# EasyEDA Pro project ir2104_V2.1.eprj

# Schematic Schematic1
Create Date: 2023-10-16; Page Name: P1_1; Project Name: ir2104_V2; Schematic Name: Schematic1; Update Date: 2023-10-16; Company: 嘉立创EDA; Page Size: A4; Version: V1.0
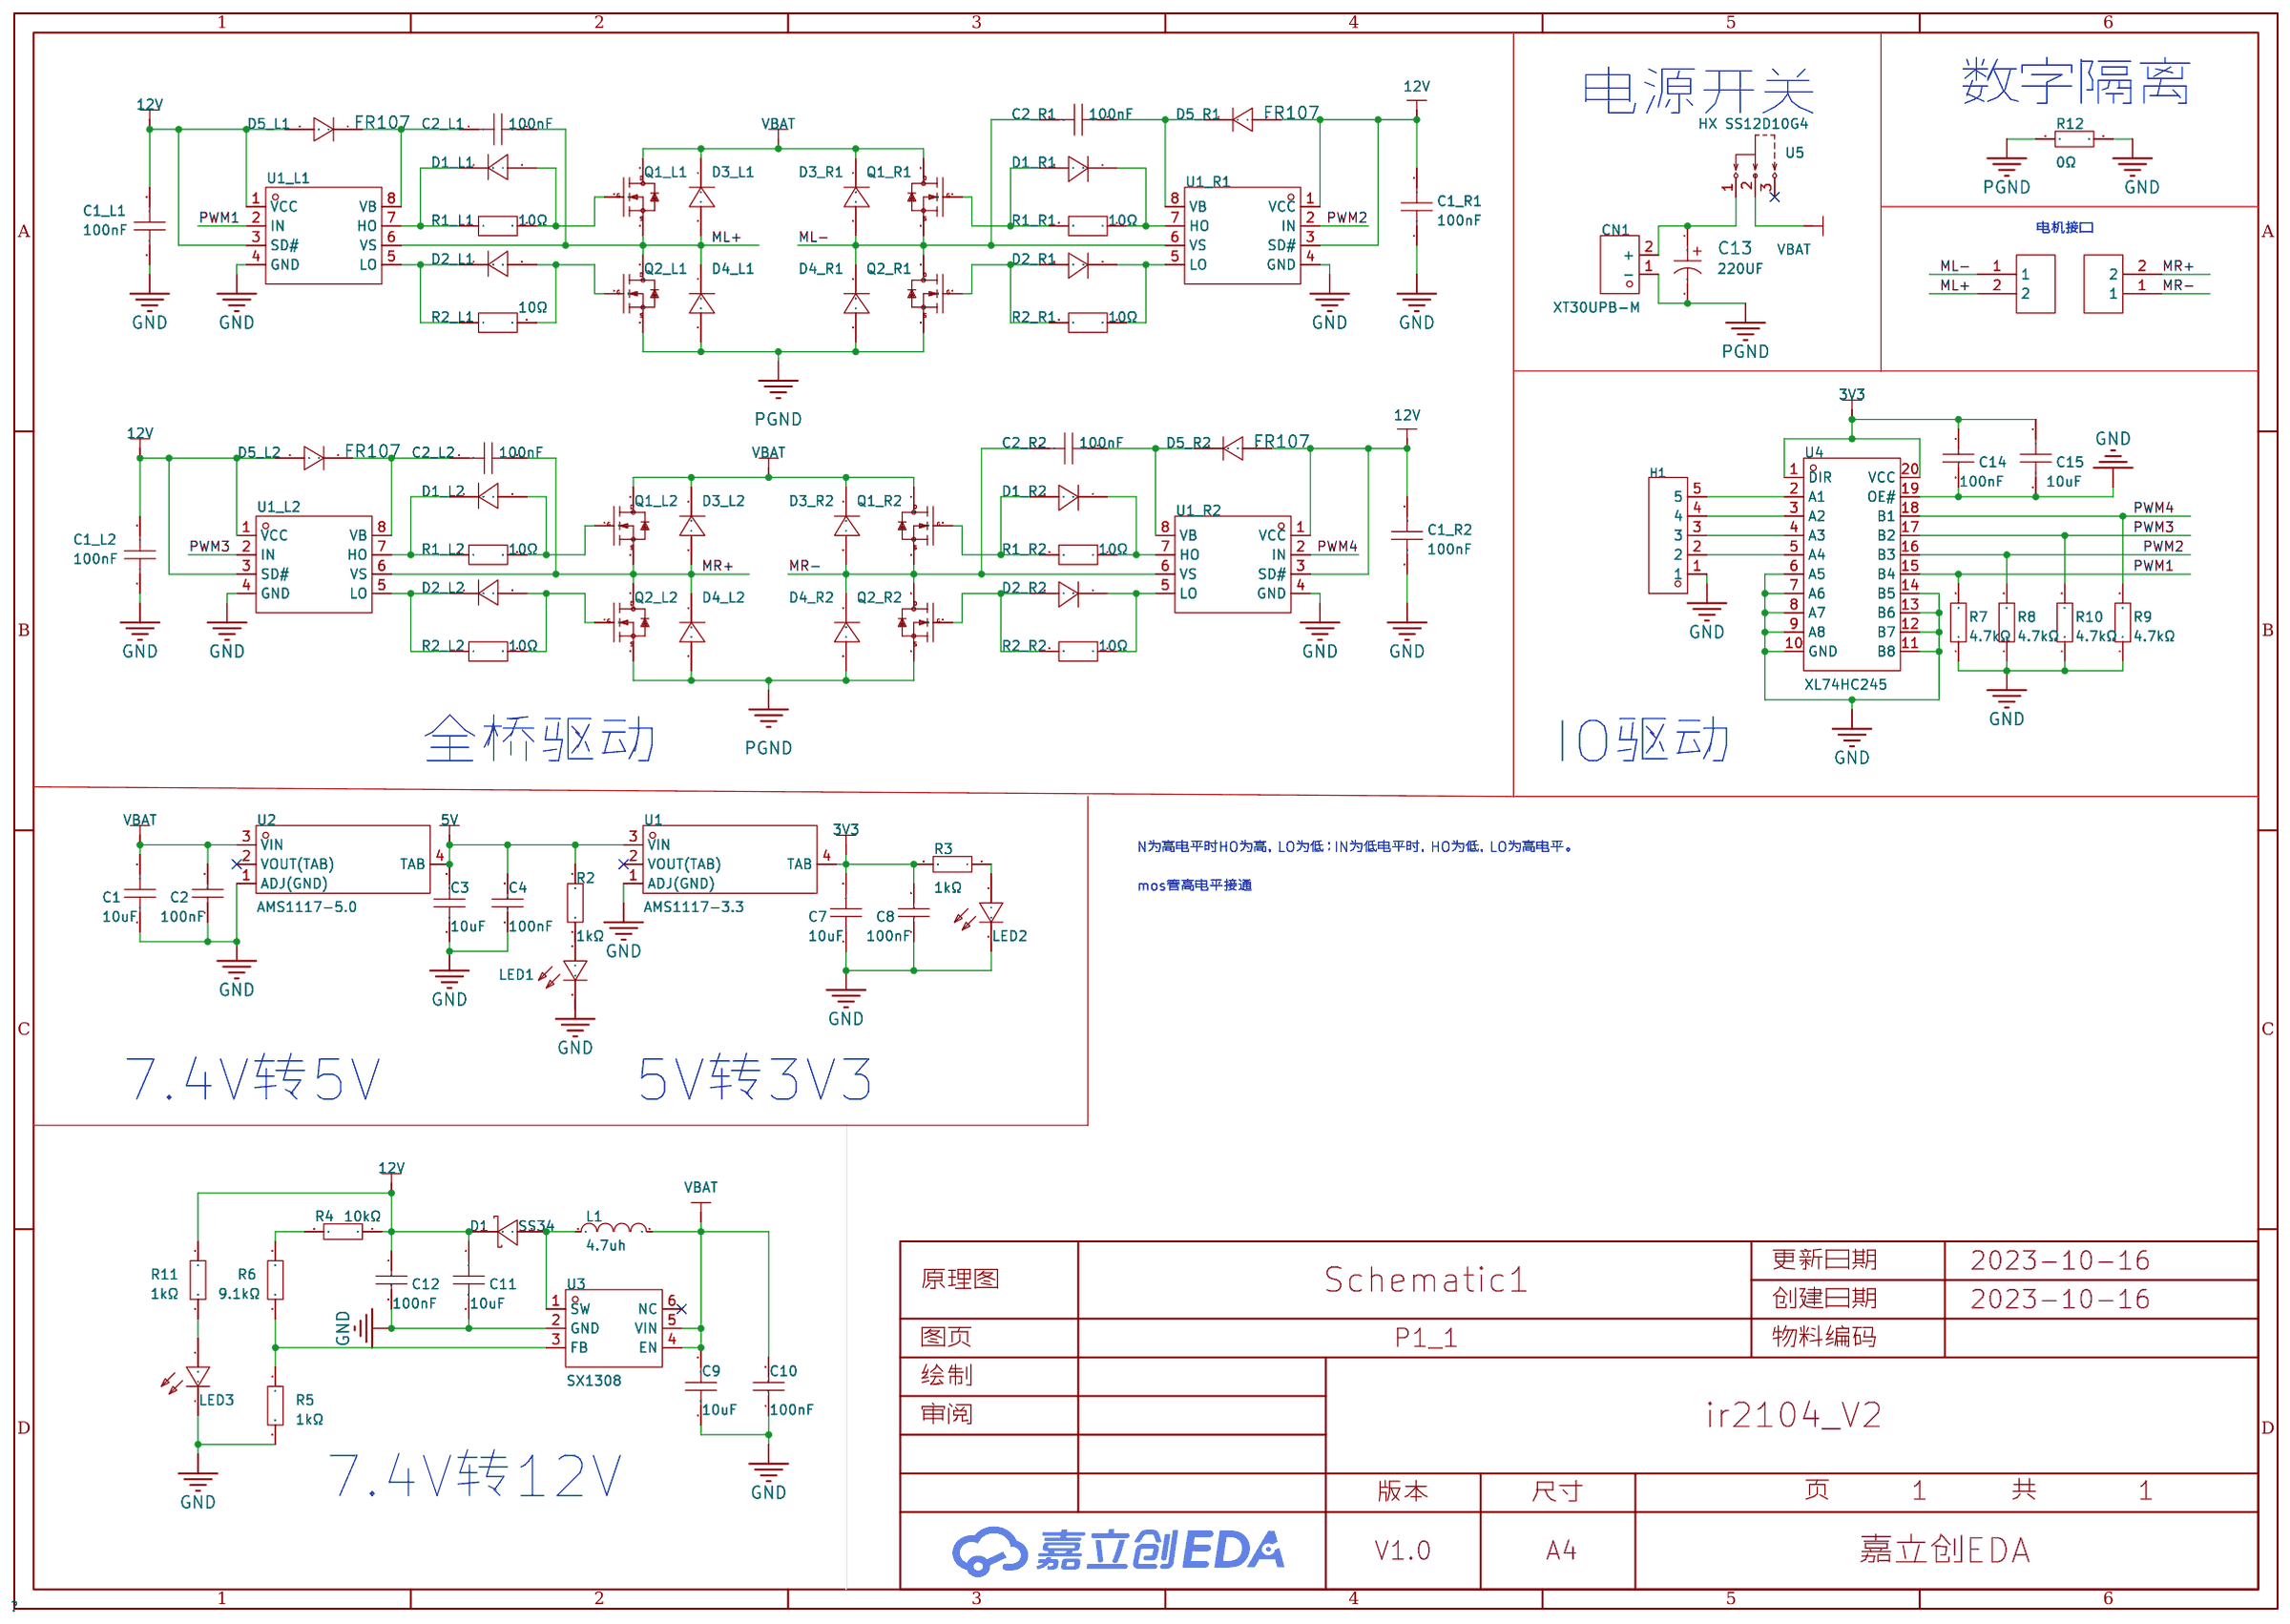
[diagram p0: schematic sheet]

## Parts
C1  10uF  [C0603]
C1_L1  100nF  [C0603]
C1_L2  100nF  [C0603]
C1_R1  100nF  [C0603]
C1_R2  100nF  [C0603]
C2  100nF  [C0603]
C2_L1  100nF  [C0603]
C2_L2  100nF  [C0603]
C2_R1  100nF  [C0603]
C2_R2  100nF  [C0603]
C3  10uF  [C0603]
C4  100nF  [C0603]
C7  10uF  [C0603]
C8  100nF  [C0603]
C9  10uF  [C0603]
C10  100nF  [C0603]
C11  10uF  [C0603]
C12  100nF  [C0603]
C13  220UF  [CAP-SMD_BD8.0-L8.3-W8.3-LS9.3-FD]
C14  100nF  [C0603]
C15  10uF  [C0603]
CN1  XT30UPB-M  [CONN-TH_XT30UPB-M]
D1  SS34  [SMA_L4.3-W2.6-LS5.2-RD]
D1_L1  US1M  [SMA_L4.4-W2.8-LS5.4-RD]
D1_L2  US1M  [SMA_L4.4-W2.8-LS5.4-RD]
D1_R1  US1M  [SMA_L4.4-W2.8-LS5.4-RD]
D1_R2  US1M  [SMA_L4.4-W2.8-LS5.4-RD]
D2_L1  US1M  [SMA_L4.4-W2.8-LS5.4-RD]
D2_L2  US1M  [SMA_L4.4-W2.8-LS5.4-RD]
D2_R1  US1M  [SMA_L4.4-W2.8-LS5.4-RD]
D2_R2  US1M  [SMA_L4.4-W2.8-LS5.4-RD]
D3_L1  US1M  [SMA_L4.4-W2.8-LS5.4-RD]
D3_L2  US1M  [SMA_L4.4-W2.8-LS5.4-RD]
D3_R1  US1M  [SMA_L4.4-W2.8-LS5.4-RD]
D3_R2  US1M  [SMA_L4.4-W2.8-LS5.4-RD]
D4_L1  US1M  [SMA_L4.4-W2.8-LS5.4-RD]
D4_L2  US1M  [SMA_L4.4-W2.8-LS5.4-RD]
D4_R1  US1M  [SMA_L4.4-W2.8-LS5.4-RD]
D4_R2  US1M  [SMA_L4.4-W2.8-LS5.4-RD]
D5_L1  FR107  [SOD-123_L2.8-W1.8-LS3.7-RD]
D5_L2  FR107  [SOD-123_L2.8-W1.8-LS3.7-RD]
D5_R1  FR107  [SOD-123_L2.8-W1.8-LS3.7-RD]
D5_R2  FR107  [SOD-123_L2.8-W1.8-LS3.7-RD]
H1  PZ254V-11-05P  [HDR-TH_5P-P2.54-V-M]
L1  4.7uh  [IND-SMD_L7.3-W6.6]
LED1  NCD0603R1  [LED0603-RD_RED]
LED2  NCD0603R1  [LED0603-RD_RED]
LED3  NCD0603R1  [LED0603-RD_RED]
P1  WJ500V-5.08-2P  [CONN-TH_2P-P5.00_WJ500V-5.08-2P]
P2  WJ500V-5.08-2P  [CONN-TH_2P-P5.00_WJ500V-5.08-2P]
Q1_L1  IRFR3607TRPBF  [TO-252-3_L6.5-W5.8-P4.58-BL]
Q1_L2  IRFR3607TRPBF  [TO-252-3_L6.5-W5.8-P4.58-BL]
Q1_R1  IRFR3607TRPBF  [TO-252-3_L6.5-W5.8-P4.58-BL]
Q1_R2  IRFR3607TRPBF  [TO-252-3_L6.5-W5.8-P4.58-BL]
Q2_L1  IRFR3607TRPBF  [TO-252-3_L6.5-W5.8-P4.58-BL]
Q2_L2  IRFR3607TRPBF  [TO-252-3_L6.5-W5.8-P4.58-BL]
Q2_R1  IRFR3607TRPBF  [TO-252-3_L6.5-W5.8-P4.58-BL]
Q2_R2  IRFR3607TRPBF  [TO-252-3_L6.5-W5.8-P4.58-BL]
R1_L1  10Ω  [R0603]
R1_L2  10Ω  [R0603]
R1_R1  10Ω  [R0603]
R1_R2  10Ω  [R0603]
R2  1kΩ  [R0603]
R2_L1  10Ω  [R0603]
R2_L2  10Ω  [R0603]
R2_R1  10Ω  [R0603]
R2_R2  10Ω  [R0603]
R3  1kΩ  [R0603]
R4  10kΩ  [R0603]
R5  1kΩ  [R0603]
R6  9.1kΩ  [R0603]
R7  4.7kΩ  [R0603]
R8  4.7kΩ  [R0603]
R9  4.7kΩ  [R0603]
R10  4.7kΩ  [R0603]
R11  1kΩ  [R0603]
R12  0Ω  [R0805]
U1  AMS1117-3.3  [SOT-223-4_L6.5-W3.5-P2.30-LS7.0-BR]
U1_L1  EG2104  [SOP-8_L5.0-W4.0-P1.27-LS6.2-BL]
U1_L2  EG2104  [SOP-8_L5.0-W4.0-P1.27-LS6.2-BL]
U1_R1  EG2104  [SOP-8_L5.0-W4.0-P1.27-LS6.2-BL]
U1_R2  EG2104  [SOP-8_L5.0-W4.0-P1.27-LS6.2-BL]
U2  AMS1117-5.0  [SOT-223_L6.7-W3.5-P2.30-BR]
U3  SX1308  [SOT-23-6_L2.9-W1.6-P0.95-LS2.8-BL]
U4  XL74HC245  [SOP-20_L12.8-W7.5-P1.27-LS10.4-BL]
U5  HX SS12D10G4  [SW-TH_SHOU-HAN_SS12D10G4]

## Library data of the parts
C1 C3 C7 C9 C11 C15 = CL10A106MA8NRNC: 容值:10uF;精度:±20%;额定电压:25V;材质(温度系数):X5R;; LCSC Part Name: 10uF ±20% 25V; Supplier Part: C96446; Manufacturer: SAMSUNG(三星); Supplier Footprint: 0603; JLCPCB Part Class: Basic Part; Datasheet: https://atta.szlcsc.com/upload/public/pdf/source/20170325/1490427913016.pdf; Supplier: LCSC; Tolerance: ±20%; Voltage Rated: 25V; Temperature Coefficient: X5R
C1_L1 C1_L2 C1_R1 C1_R2 C2_L1 C2_L2 C2_R1 C2_R2 = CL10B104KB8NNNC: 容值:100nF;精度:±10%;额定电压:50V;材质(温度系数):X7R;; LCSC Part Name: 100nF±10%50V; Supplier Part: C1591; Manufacturer: SAMSUNG(三星); Supplier Footprint: 0603; JLCPCB Part Class: 扩展库; Datasheet: https://atta.szlcsc.com/upload/public/pdf/source/20160103/1457707680512.pdf; Supplier: LCSC; Tolerance: ±10%; Voltage Rated: 50V; Temperature Coefficient: X7R
C2 C4 C8 C10 C12 C14 = 0603B104K500NT: 容值:100nF;精度:±10%;额定电压:50V;材质(温度系数):X7R;; LCSC Part Name: 100nF ±10% 50V; Supplier Part: C30926; Manufacturer: FH(风华); Supplier Footprint: 0603; JLCPCB Part Class: Extended Part; Datasheet: https://atta.szlcsc.com/upload/public/pdf/source/20170923/C30926_1506149436298988724.pdf; Supplier: LCSC; Tolerance: ±10%; Voltage Rated: 50V; Temperature Coefficient: X7R
C13 = FZ470UF16V90RV0148: LCSC Part Name: 贴片型铝电解电容 470UF 16V; Supplier Part: C5155342; Manufacturer: KNSCHA(科尼盛); Supplier Footprint: SMD,8x10.5mm; JLCPCB Part Class: Extended Part; Supplier: LCSC
CN1 = XT30UPB-M: LCSC Part Name: AMASS(艾迈斯)板载立式 航模锂电池控制器连接器插头 公头XT30UPB-M; Supplier Part: C428721; Manufacturer: AMASS(艾迈斯); JLCPCB Part Class: Extended Part; Datasheet: https://atta.szlcsc.com/upload/public/pdf/source/20230412/7B5DFEF57C9EA5273853390C734B3AC5.pdf; Supplier: LCSC
D1 = SS34_C8678: 二极管配置:独立式;直流反向耐压(Vr):40V;平均整流电流(Io):3A;正向压降(Vf):550mV@3A;; LCSC Part Name: 40V 3A 550mV@3A; Supplier Part: C8678; Manufacturer: MDD; Supplier Footprint: SMA(DO-214AC); JLCPCB Part Class: Basic Part; Datasheet: https://atta.szlcsc.com/upload/public/pdf/source/20230314/A80AE34493C69B89E2F4B1712F433538.pdf; Supplier: LCSC; Diode Configuration: 独立式; Reverse Voltage (Vr): 40V; Average Rectified Current (Io): 3A; Forward Voltage (Vf@If): 550mV@3A; Reverse Leakage Current (Ir): 500uA@40V
D1_L1 D1_L2 D1_R1 D1_R2 D2_L1 D2_L2 D2_R1 D2_R2 D3_L1 D3_L2 D3_R1 D3_R2 D4_L1 D4_L2 D4_R1 D4_R2 = US1M_C412437: 二极管配置:独立式;直流反向耐压(Vr):1kV;平均整流电流(Io):1A;正向压降(Vf):1.7V@1A;反向电流(Ir):5uA@1kV;反向恢复时间(trr):75ns;工作温度:-50℃~+150℃@(Tj);; LCSC Part Name: 1kV1A75ns; Supplier Part: C412437; Manufacturer: MDD; Supplier Footprint: SMA; JLCPCB Part Class: BasicPart; Datasheet: https://atta.szlcsc.com/upload/public/pdf/source/20200710/C412437_A2B0E4A2AF6F53946A2ACCD8257B288E.pdf; Supplier: LCSC; Diode Configuration: 独立式; Reverse Voltage (Vr): 1kV; Average Rectified Current (Io): 1A; Forward Voltage (Vf@If): 1.7V@1A; Reverse Leakage Current: 5uA@1kV; Reverse Recovery Time (trr): 75ns; Operating Temperature: -50℃~+150℃@(Tj)
D5_L1 D5_L2 D5_R1 D5_R2 = FR107_C511885: 二极管配置:-;直流反向耐压(Vr):1kV;平均整流电流(Io):1A;正向压降(Vf):1.3V@1A;反向电流(Ir):5uA@1kV;反向恢复时间(trr):500ns;工作温度:-55℃~+150℃@(Tj);; LCSC Part Name: 1kV1A500ns; Supplier Part: C511885; Manufacturer: BORN(伯恩半导体); Supplier Footprint: SOD-123; JLCPCB Part Class: 扩展库; Datasheet: https://atta.szlcsc.com/upload/public/pdf/source/20200413/C511885_F5BBF7A87475723E74BE0D118A106A7A.pdf; Supplier: LCSC; Reverse Voltage (Vr): 1kV; Average Rectified Current (Io): 1A; Forward Voltage (Vf@If): 1.3V@1A; Reverse Leakage Current: 5uA@1kV; Reverse Recovery Time (trr): 500ns; Operating Temperature: -55℃~+150℃@(Tj)
H1 = PZ254V-11-05P: 排数:单排;总PIN位数:5P;间距:2.54mm;插针结构:1x5P;行距:-;安装类型:直插;圆针/方针:方针;额定电流:-;额定电压:-;配合针长度:6mm;塑高:2.5mm;端接针长度:3mm;触头材质:黄铜;触头镀层:-;工作温度范围:-40℃~+105℃;颜色:黑色;; LCSC Part Name: 2.54mm 1x5P 直插 方针; Supplier Part: C492404; Manufacturer: XFCN(兴飞); Supplier Footprint: 插件,P=2.54mm; JLCPCB Part Class: Extended Part; Datasheet: https://atta.szlcsc.com/upload/public/pdf/source/20200309/C492404_E51533260F8710EFF5D4617281164C1D.pdf; Supplier: LCSC; Number of Rows: 单排; Number of Pins: 5P; Pitch: 2.54mm; Pin Structure: 1x5P; Mounting Type: 直插; Circluar Pins/Square Pins: 方针; Length of Mating Pin: 6mm; Insulation Height: 2.5mm; Length of End Connection Pin: 3mm; Contact Material: 黄铜; Operating Temperature Range: -40℃~+105℃; Color: 黑色
L1 = SMMS0630-100M: 电感值:10uH;精度:±20%;额定电流:-;; LCSC Part Name: 10uH ±20%; Supplier Part: C128692; Manufacturer: SXN(顺翔诺); Supplier Footprint: SMD,6.6x7.3mm; JLCPCB Part Class: 扩展库; Datasheet: https://atta.szlcsc.com/upload/public/pdf/source/20210810/BBF24330FB2F5029F637830BA9C42C0D.pdf; Supplier: LCSC; Tolerance: ±20%
LED1-LED3 = NCD0603R1_C84263: 发光颜色:红灯;; LCSC Part Name: 红灯; Supplier Part: C84263; Manufacturer: 国星光电; Supplier Footprint: 0603; JLCPCB Part Class: Extended Part; Datasheet: https://atta.szlcsc.com/upload/public/pdf/source/20200820/C84263_DABC6A75E58F576973B407FDBA283D60.pdf; Supplier: LCSC; Emitted Color: 红灯
P1 P2 = WJ500V-5.08-2P: 间距:5.08mm;结构:1x2P;排数:1;每排PIN数:2;安装方式:直针;额定电流:18A;额定电压:250V;线规 - AWG:14~30;线规 - mm2:2.5;工作温度范围:-40℃~+105℃;颜色:绿色;; LCSC Part Name: 5.08mm 1x2P 排数:1 每排P数:2 直针 可拼接; Supplier Part: C8465; Manufacturer: KANGNEX(康奈克斯电气); Supplier Footprint: 插件,P=5.08mm; JLCPCB Part Class: 扩展库; Datasheet: https://atta.szlcsc.com/upload/public/pdf/source/20191225/C8465_02D34CE5B5B4A53DF5891601D97FA9F4.pdf; Supplier: LCSC; Pitch: 5.08mm; Structure: 1x2P; Number of Rows: 1; Number of PINs Per Row: 2; Mounting Style: 直针; Current Rating (Max): 18A; Voltage Rating (Max): 250V; Wire Gauge - AWG: 14~30; Wire Gauge - mm2: 2.5; Operating Temperature Range: -40℃~+105℃; Color: 绿色
Q1_L1 Q1_L2 Q1_R1 Q1_R2 Q2_L1 Q2_L2 Q2_R1 Q2_R2 = IRFR3607TRPBF: 类型:N沟道;漏源电压(Vdss):75V;连续漏极电流(Id):56A;功率(Pd):140W;导通电阻(RDS(on)@Vgs,Id):9mΩ@10V,46A;阈值电压(Vgs(th)@Id):4V@100uA;; LCSC Part Name: N沟道75V56A; Supplier Part: C74775; Manufacturer: Infineon(英飞凌); Supplier Footprint: TO-252-2(DPAK); JLCPCB Part Class: 扩展库; Datasheet: https://atta.szlcsc.com/upload/public/pdf/source/20180125/C74775_15168616818461301901.pdf; Supplier: LCSC; Type: N沟道; Drain Source Voltage (Vdss): 75V; Continuous Drain Current (Id): 56A; Power Dissipation (Pd): 140W; Drain Source On Resistance (RDS(on)@Vgs,Id): 9mΩ@10V,46A; Gate Threshold Voltage (Vgs(th)@Id): 4V@100uA
R1_L1 R1_L2 R1_R1 R1_R2 R2_L1 R2_L2 R2_R1 R2_R2 = ERJUP3D10R0V: 阻值:10Ω;精度:±0.5%;功率:250mW;; LCSC Part Name: 10Ω±0.5%250mW; Supplier Part: C491216; Manufacturer: PANASONIC(松下); Supplier Footprint: 0603; JLCPCB Part Class: 扩展库; Datasheet: https://atta.szlcsc.com/upload/public/pdf/source/20200407/C491216_2E39EC09AE614A2EE2B1246D53854D38.pdf; Supplier: LCSC; Tolerance: ±0.5%; Power(Watts): 250mW
R2 R3 R11 = 0603WAF1001T5E: 电阻类型:厚膜电阻;阻值:1kΩ;精度:±1%;功率:100mW;; LCSC Part Name: 1kΩ ±1% 100mW; Supplier Part: C21190; Manufacturer: UNI-ROYAL(厚声); Supplier Footprint: 0603; JLCPCB Part Class: Basic Part; Datasheet: https://atta.szlcsc.com/upload/public/pdf/source/20200306/C422600_1E6D84923E4A46A82E41ADD87F860B5C.pdf; Supplier: LCSC; Type: 厚膜电阻; Tolerance: ±1%; Power(Watts): 100mW; Temperature Coefficient: ±100ppm/℃; Overload Voltage (Max): 75V; Operating Temperature Range: -55℃~+155℃
R4 = RT0603BRD0710KL: 电阻类型:薄膜电阻;阻值:10kΩ;精度:±0.1%;功率:100mW;; LCSC Part Name: 10kΩ ±0.1% 100mW; Supplier Part: C95204; Manufacturer: YAGEO(国巨); Supplier Footprint: 0603; JLCPCB Part Class: Extended Part; Datasheet: https://atta.szlcsc.com/upload/public/pdf/source/20170217/1487301593756.pdf; Supplier: LCSC; Type: 薄膜电阻; Tolerance: ±0.1%; Power(Watts): 100mW; Temperature Coefficient: ±25ppm/℃; Overload Voltage (Max): 75V; Operating Temperature Range: -55℃~+155℃
R5 = RT0603BRD071KL: 电阻类型:薄膜电阻;阻值:1kΩ;精度:±0.1%;功率:100mW;; LCSC Part Name: 1kΩ ±0.1% 100mW; Supplier Part: C110776; Manufacturer: YAGEO(国巨); Supplier Footprint: 0603; JLCPCB Part Class: Extended Part; Datasheet: https://atta.szlcsc.com/upload/public/pdf/source/20170704/1499151282044.pdf; Supplier: LCSC; Type: 薄膜电阻; Tolerance: ±0.1%; Power(Watts): 100mW; Temperature Coefficient: ±25ppm/℃; Overload Voltage (Max): 75V; Operating Temperature Range: -55℃~+155℃
R6 = PTFR0603B9K10P9: 电阻类型:薄膜电阻;阻值:9.1kΩ;精度:±0.1%;功率:100mW;; LCSC Part Name: 9.1kΩ ±0.1% 100mW; Supplier Part: C351620; Manufacturer: RESI(开步睿思）; Supplier Footprint: 0603; JLCPCB Part Class: Extended Part; Datasheet: https://atta.szlcsc.com/upload/public/pdf/source/20200421/C328426_1F8A6F869BB4A34F9E140D3E05CCCC70.pdf; Supplier: LCSC; Type: 薄膜电阻; Tolerance: ±0.1%; Power(Watts): 100mW; Temperature Coefficient: ±25ppm/℃; Overload Voltage (Max): 100V; Operating Temperature Range: -55℃~+125℃
R7-R10 = 0603WAF4701T5E: 电阻类型:厚膜电阻;阻值:4.7kΩ;精度:±1%;功率:100mW;; LCSC Part Name: 4.7kΩ ±1% 100mW; Supplier Part: C23162; Manufacturer: UNI-ROYAL(厚声); Supplier Footprint: 0603; JLCPCB Part Class: Basic Part; Datasheet: https://atta.szlcsc.com/upload/public/pdf/source/20200306/C422600_1E6D84923E4A46A82E41ADD87F860B5C.pdf; Supplier: LCSC; Type: 厚膜电阻; Tolerance: ±1%; Power(Watts): 100mW; Temperature Coefficient: ±100ppm/℃; Overload Voltage (Max): 75V; Operating Temperature Range: -55℃~+155℃
R12 = 0805W8F0000T5E: 电阻类型:厚膜电阻;阻值:0Ω;精度:±1%;功率:125mW;; LCSC Part Name: 0Ω ±1% 125mW; Supplier Part: C17477; Manufacturer: UNI-ROYAL(厚声); Supplier Footprint: 0805; JLCPCB Part Class: Basic Part; Datasheet: https://atta.szlcsc.com/upload/public/pdf/source/20200306/C422600_1E6D84923E4A46A82E41ADD87F860B5C.pdf; Supplier: LCSC; Type: 厚膜电阻; Tolerance: ±1%; Power(Watts): 125mW; Temperature Coefficient: ±800ppm/℃; Overload Voltage (Max): 150V; Operating Temperature Range: -55℃~+155℃
U1 = AMS1117-3.3_C347222: 输出类型:固定;输出极性:正;最大输入电压:18V;输出电压:3.3V;输出电流:1A;电源纹波抑制比(PSRR):60dB@(120Hz);; Supplier Part: C347222; Manufacturer: UMW(广东友台半导体); Supplier Footprint: SOT-223; JLCPCB Part Class: Extended Part; Datasheet: https://atta.szlcsc.com/upload/public/pdf/source/20211011/50CC665C22E3A66C08379A4A74BDA25C.pdf; Supplier: LCSC; Output Type: 固定; Output Polarity: 正; Number of Outputs: 1; Maximum Input Voltage: 18V; Output Voltage: 3.3V; Dropout Voltage: 1.3V@(1A); Output Current: 1A; Power Supply Rejection Ratio (PSRR): 60dB@(120Hz)
U1_L1 U1_L2 U1_R1 U1_R2 = EG2104: 高性价比,600V，半桥式Nmos预驱动器; Supplier Part: C186697; Manufacturer: EG(屹晶微); Supplier Footprint: SOP-8-150mil; JLCPCB Part Class: 扩展库; Datasheet: https://atta.szlcsc.com/upload/public/pdf/source/20220627/4CCFA0CAB664067FEE4AF87E4129127F.pdf; Supplier: LCSC
U2 = AMS1117-5.0_C347223: 输出类型:固定;输出极性:正;最大输入电压:18V;输出电压:5V;输出电流:1A;电源纹波抑制比(PSRR):60dB@(120Hz);; LCSC Part Name: 输入18V 输出5V 1A; Supplier Part: C347223; Manufacturer: UMW(广东友台半导体); Supplier Footprint: SOT-223; JLCPCB Part Class: Extended Part; Datasheet: https://atta.szlcsc.com/upload/public/pdf/source/20211011/50CC665C22E3A66C08379A4A74BDA25C.pdf; Supplier: LCSC; Output Type: 固定; Output Polarity: 正; Number of Outputs: 1; Maximum Input Voltage: 18V; Output Voltage: 5V; Dropout Voltage: 1.3V@(1A); Output Current: 1A; Power Supply Rejection Ratio (PSRR): 60dB@(120Hz)
U3 = SX1308: 功能类型:升压型;同步整流:否;输出通道数:1;拓扑结构:升压式;输入电压:2V~24V;输出电压:28V;输出电流(最大值):-;开关频率:1.2MHz;; LCSC Part Name: 升压型 Vin=2V~24V Vout=28V; Supplier Part: C78162; Manufacturer: SX(硕芯科技); Supplier Footprint: SOT-23-6; JLCPCB Part Class: Extended Part; Datasheet: https://atta.szlcsc.com/upload/public/pdf/source/20160920/1474356679185.pdf; Supplier: LCSC; Function: 升压型; Synchronous Rectification: 否; Number of Outputs: 1; Topology: 升压式; Input Voltage: 2V~24V; Output Voltage: 28V; Switching Frequency: 1.2MHz
U4 = XL74HC245: 八路总线收发器; LCSC Part Name: 总线收发器; Supplier Part: C561304; Manufacturer: XINLUDA(信路达); Supplier Footprint: SOP-20; JLCPCB Part Class: Extended Part; Datasheet: https://atta.szlcsc.com/upload/public/pdf/source/20200529/C561304_A214D245EEE9B91D1EB7AEB54AB3B76F.pdf; Supplier: LCSC
U5 = HX SS12D10G4: LCSC Part Name: 拨动开关 立式两档拨动,单排3脚插件,12.7x6.7x6.4,黑柄4mm; Supplier Part: C5149841; Manufacturer: hanxia(韩下); Supplier Footprint: 插件; JLCPCB Part Class: 扩展库; Datasheet: https://atta.szlcsc.com/upload/public/pdf/source/20220907/2020D7183ED16DD6E2B9F5A13FB144CF.pdf; Supplier: LCSC

## Nets
3V3: C7.2 C8.2 C14.1 C15.1 R3.2 U1.4(TAB) U4.1(DIR) U4.20(VCC)
5V: C3.2 C4.2 R2.1 U1.3(VIN) U2.4(TAB)
12V: C1_L1.2 C1_L2.2 C1_R1.2 C1_R2.2 C11.1 C12.1 D1.1(K) D5_L1.2(A) D5_L2.2(A) D5_R1.2(A) D5_R2.2(A) R4.1 R11.1 U1_L1.1(VCC) U1_L1.3(SD#) U1_L2.1(VCC) U1_L2.3(SD#) U1_R1.1(VCC) U1_R1.3(SD#) U1_R2.1(VCC) U1_R2.3(SD#)
GND: C1.1 C1_L1.1 C1_L2.1 C1_R1.1 C1_R2.1 C2.1 C3.1 C4.1 C7.1 C8.1 C9.1 C10.1 C11.2 C12.2 C14.2 C15.2 H1.1 LED1.1(K) LED2.1(K) LED3.1(K) R5.2 R7.1 R8.1 R9.1 R10.1 R12.2 U1.1(ADJ(GND)) U1_L1.4(GND) U1_L2.4(GND) U1_R1.4(GND) U1_R2.4(GND) U2.1(ADJ(GND)) U3.2(GND) U4.6(A5) U4.7(A6) U4.8(A7) U4.9(A8) U4.10(GND) U4.11(B8) U4.12(B7) U4.13(B6) U4.14(B5) U4.19(OE#)
PGND: C13.2 CN1.1(-) D4_L1.2(A) D4_L2.2(A) D4_R1.2(A) D4_R2.2(A) Q2_L1.3(S) Q2_L2.3(S) Q2_R1.3(S) Q2_R2.3(S) R12.1
VBAT: C1.2 C2.2 C9.2 C10.2 D3_L1.1(C) D3_L2.1(C) D3_R1.1(C) D3_R2.1(C) L1.2 Q1_L1.2(D) Q1_L2.2(D) Q1_R1.2(D) Q1_R2.2(D) U2.3(VIN) U3.4(EN) U3.5(VIN) U5.2
ML+: C2_L1.2 D3_L1.2(A) D4_L1.1(C) P1.2 Q1_L1.3(S) Q2_L1.2(D) U1_L1.6(VS)
ML-: C2_R1.2 D3_R1.2(A) D4_R1.1(C) P1.1 Q1_R1.3(S) Q2_R1.2(D) U1_R1.6(VS)
MR+: C2_L2.2 D3_L2.2(A) D4_L2.1(C) P2.2 Q1_L2.3(S) Q2_L2.2(D) U1_L2.6(VS)
MR-: C2_R2.2 D3_R2.2(A) D4_R2.1(C) P2.1 Q1_R2.3(S) Q2_R2.2(D) U1_R2.6(VS)
PWM1: R7.2 U1_L1.2(IN) U4.15(B4)
PWM2: R8.2 U1_R1.2(IN) U4.16(B3)
PWM3: R10.2 U1_L2.2(IN) U4.17(B2)
PWM4: R9.2 U1_R2.2(IN) U4.18(B1)
$3N995: D2_L1.2(A) Q2_L1.1(G) R2_L1.2
$3N996: D1_L1.1(C) R1_L1.1 U1_L1.7(HO)
$3N997: D2_L1.1(C) R2_L1.1 U1_L1.5(LO)
$3N999: C2_L1.1 D5_L1.1(K) U1_L1.8(VB)
$3N1006: D1_R1.1(C) R1_R1.1 U1_R1.7(HO)
$3N1007: D1_R1.2(A) Q1_R1.1(G) R1_R1.2
$3N1008: D2_R1.1(C) R2_R1.1 U1_R1.5(LO)
$3N1009: D2_R1.2(A) Q2_R1.1(G) R2_R1.2
$3N1011: C2_R1.1 D5_R1.1(K) U1_R1.8(VB)
$3N1019: D1_L1.2(A) Q1_L1.1(G) R1_L1.2
$3N2169: D2_L2.2(A) Q2_L2.1(G) R2_L2.2
$3N2170: D1_L2.1(C) R1_L2.1 U1_L2.7(HO)
$3N2171: D2_L2.1(C) R2_L2.1 U1_L2.5(LO)
$3N2173: C2_L2.1 D5_L2.1(K) U1_L2.8(VB)
$3N2190: D1_R2.1(C) R1_R2.1 U1_R2.7(HO)
$3N2191: D1_R2.2(A) Q1_R2.1(G) R1_R2.2
$3N2192: D2_R2.1(C) R2_R2.1 U1_R2.5(LO)
$3N2193: D2_R2.2(A) Q2_R2.1(G) R2_R2.2
$3N2195: C2_R2.1 D5_R2.1(K) U1_R2.8(VB)
$3N2213: D1_L2.2(A) Q1_L2.1(G) R1_L2.2
$3N2727: LED2.2(A) R3.1
$3N2731: LED1.2(A) R2.2
$3N3245: D1.2(A) L1.1 U3.1(SW)
$3N3247: R4.2 R6.2
$3N3248: R5.1 R6.1 U3.3(FB)
$3N3249: LED3.2(A) R11.2
$3N4108: C13.1 CN1.2(+) U5.1
$3N4523: H1.2 U4.5(A4)
$3N4524: H1.3 U4.4(A3)
$3N4525: H1.4 U4.3(A2)
$3N4526: H1.5 U4.2(A1)

Not connected (* = marked no-connect by the designer): U1 2(VOUT(TAB))*; U2 2(VOUT(TAB))*; U3 6(NC)*; U5 3*

## Notes on the sheet
- 数字隔离
- 电源开关
- 电机接口
- 全桥驱动
- IO驱动
- N为高电平时HO为高，LO为低；IN为低电平时，HO为低，LO为高电平。
- mos管高电平接通
- 7.4V转5V
- 5V转3V3
- 7.4V转12V

# Board PCB1
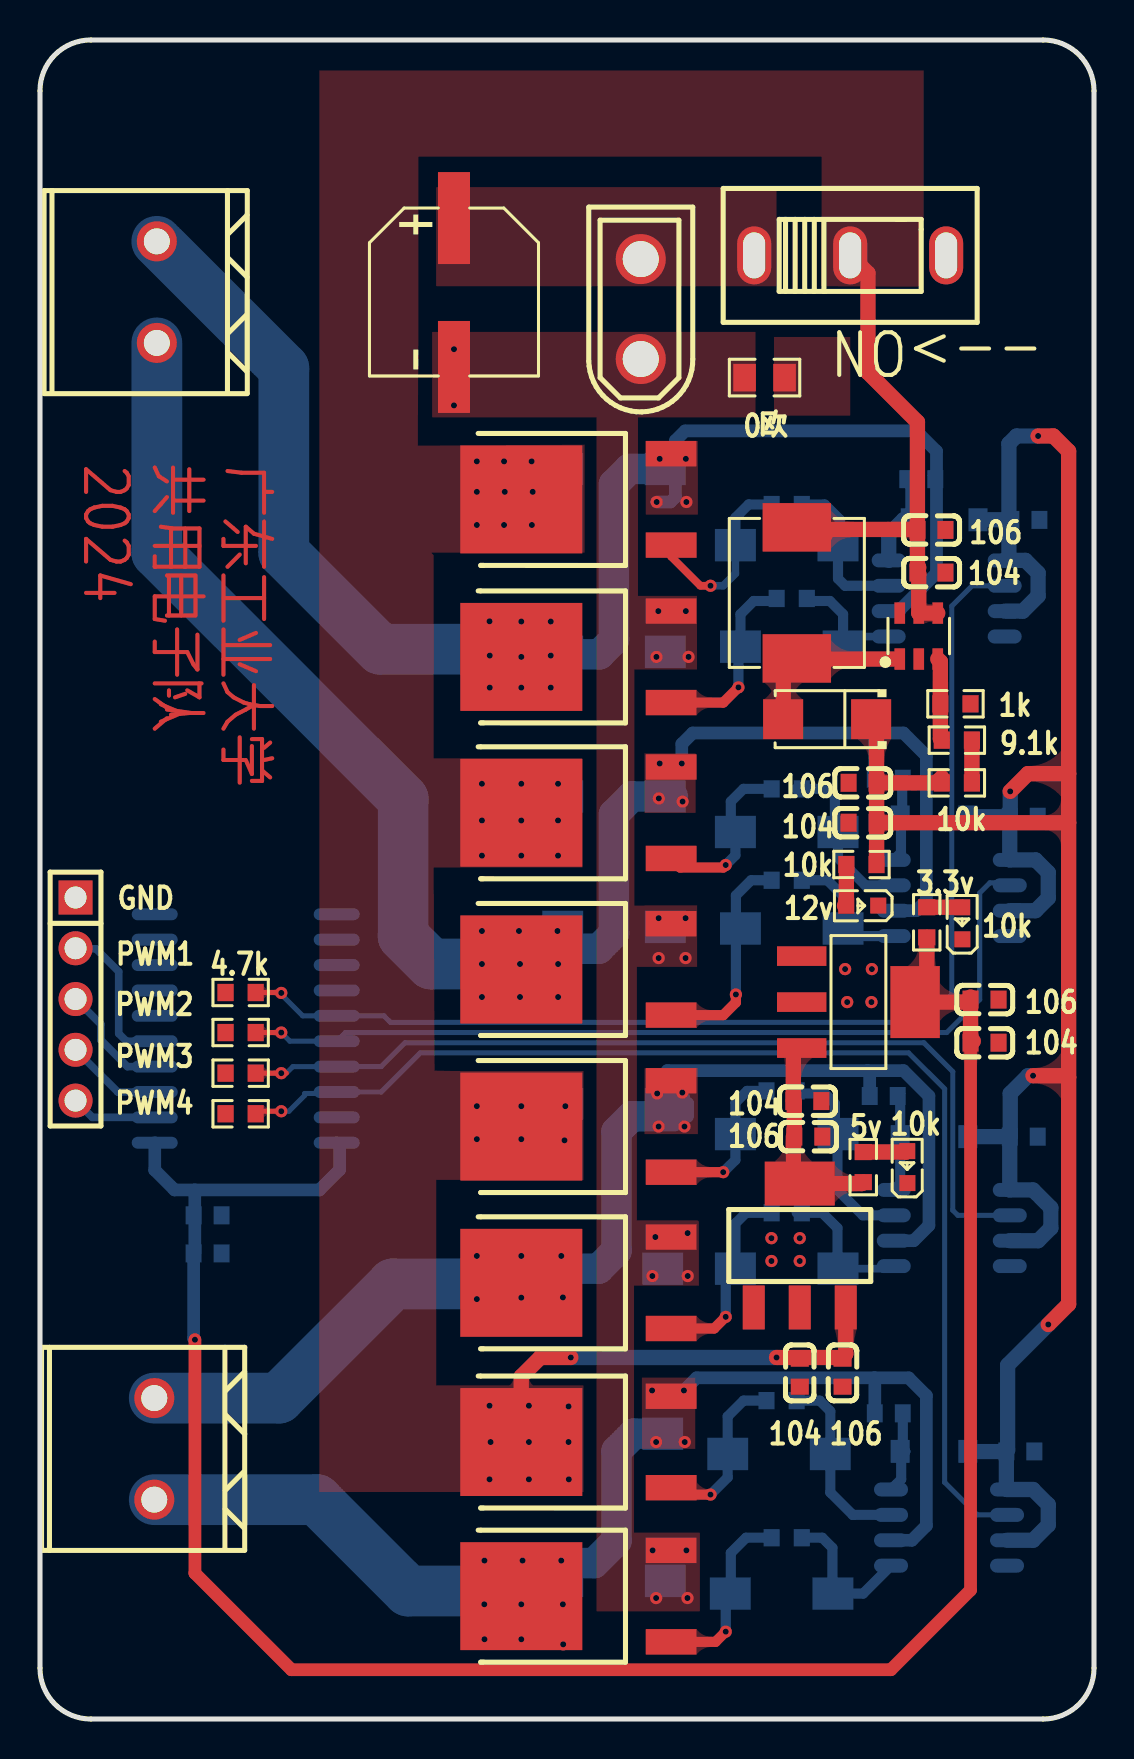
[diagram p1: board, top side]
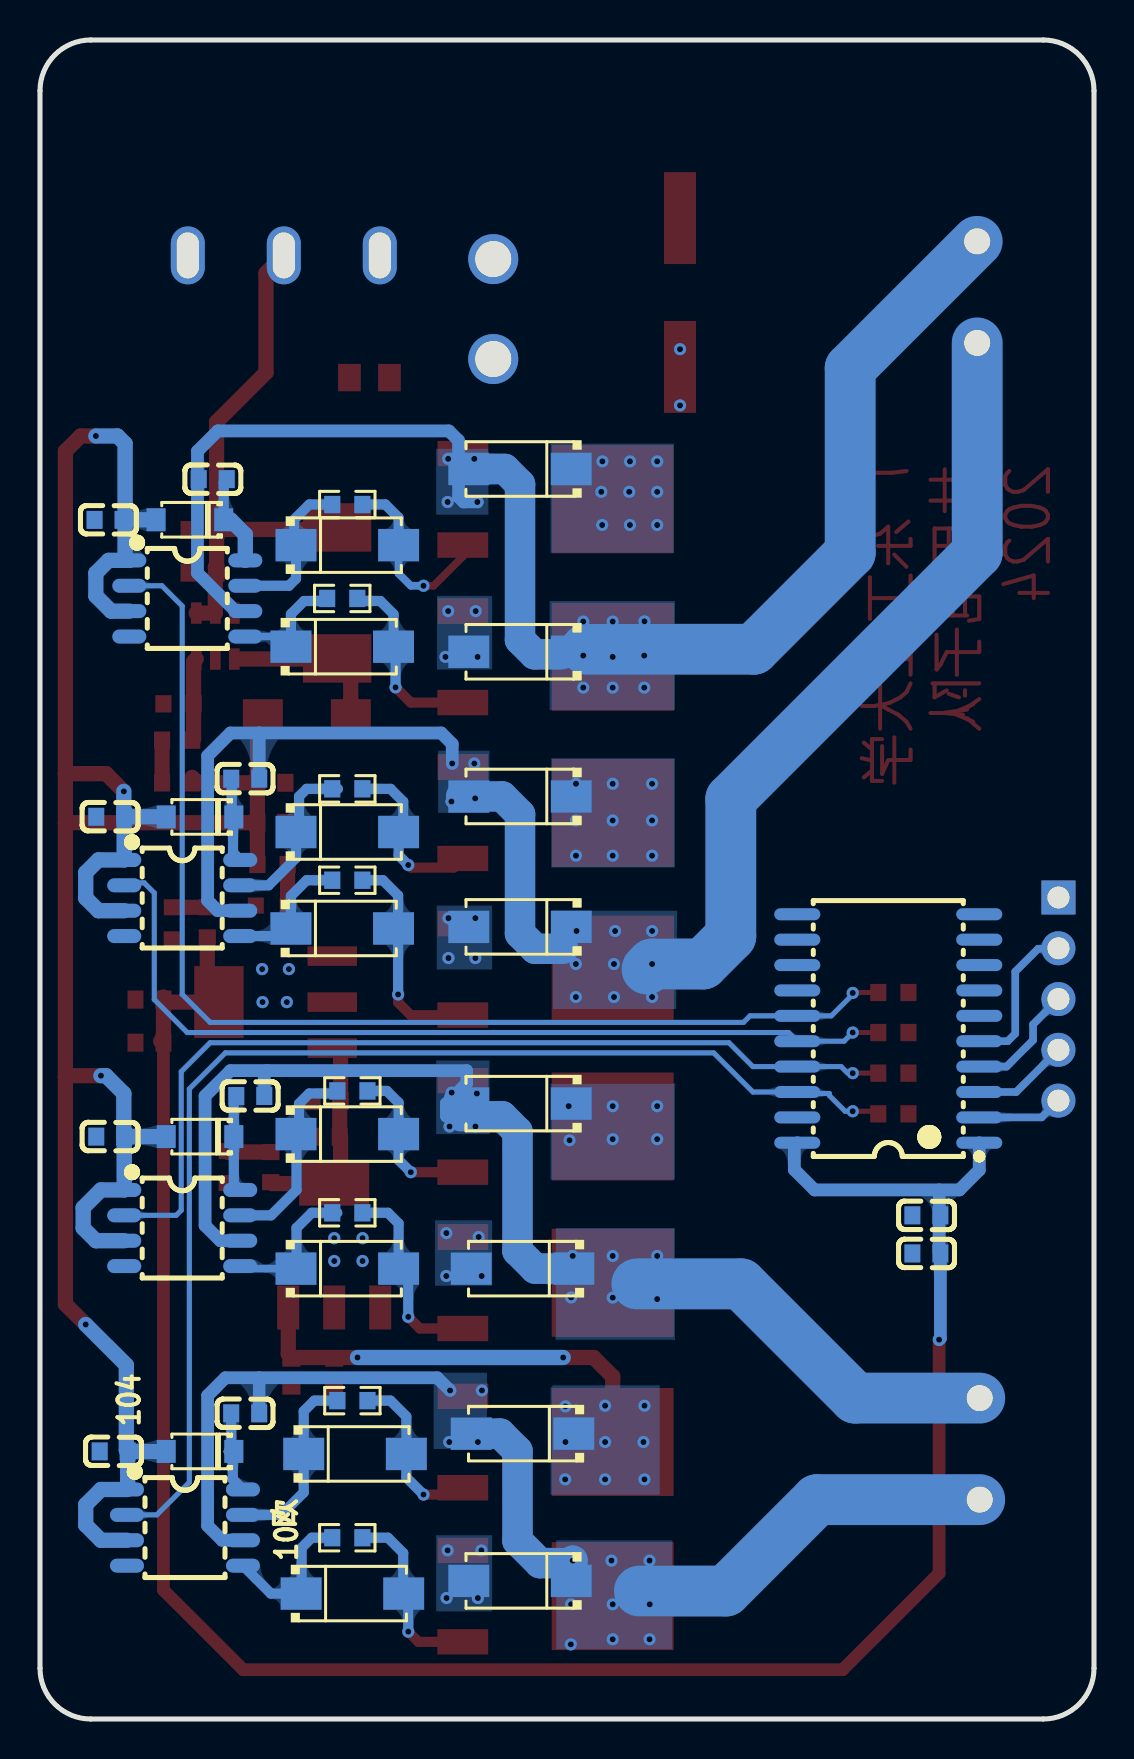
[diagram p2: board, bottom side, seen from below]

Outline 52.7 x 84 mm; copper layers: Top Layer, Bottom Layer. Coordinates in mm from the lower left corner of the outline.
Outline path: 0,81.46 0,2.54 arc(0.74,0.74) 2.54,0 50.16,0 arc(51.96,0.74) 52.7,2.54 52.7,81.46 arc(51.96,83.26) 50.16,84 2.54,84 arc(0.74,83.26) 0,81.46
Stack: Top Layer 0.035mm / Dielectric1 1.51mm FR4 er 4.5 / Bottom Layer 0.035mm

## Design rules (mm)
template: JLCPCB Capability(Two Layers Board)
spacing copperThickness1oz (default): track to track 0.102, other pairs 0.152 to 0.3
spacing copperThickness2oz: track to track 0.203, other pairs 0.152 to 0.3
track width copperThickness1oz (default): min 0.127, default 0.254, max 2.54
track width copperThickness2oz: min 0.203, default 0.254, max 2.54
differential pair differentialPair (default): width min 0.127, default 0.254, max 2.54; gap min 0.152, default 0.152
via viaSize (default): diameter min 0.5, default 0.61, max 10; hole min 0.3, default 0.305, max 6.3

## Placement (name value [footprint] x y rotation side)
C1  10uF  [C0603]  40.13 17.32 90 top
C1_L1  100nF  [C0603]  49.28 59.99 180 bottom
C1_L2  100nF  [C0603]  49.19 29.14 180 bottom
C1_R1  100nF  [C0603]  49.19 45.14 180 bottom
C1_R2  100nF  [C0603]  49.02 13.39 180 bottom
C2  100nF  [C0603]  37.99 17.32 90 top
C2_L1  100nF  [C0603]  44.07 62.03 0 bottom
C2_L2  100nF  [C0603]  42.19 31.17 180 bottom
C2_R1  100nF  [C0603]  42.44 47.04 180 bottom
C2_R2  100nF  [C0603]  42.44 15.29 180 bottom
C3  10uF  [C0603]  38.42 29.14 180 top
C4  100nF  [C0603]  38.37 30.91 180 top
C7  10uF  [C0603]  47.23 35.99 180 top
C8  100nF  [C0603]  47.23 33.83 180 top
C9  10uF  [C0603]  44.58 59.49 180 top
C10  100nF  [C0603]  44.58 57.35 180 top
C11  10uF  [C0603]  41.13 46.84 180 top
C12  100nF  [C0603]  41.13 44.84 180 top
C13  220UF  [CAP-SMD_BD8.0-L8.3-W8.3-LS9.3-FD]  20.7 71.37 270 top
C14  100nF  [C0603]  8.38 25.2 0 bottom
C15  10uF  [C0603]  8.38 23.29 0 bottom
CN1  XT30UPB-M  [CONN-TH_XT30UPB-M]  30.04 70.54 90 top
D1  SS34  [SMA_L4.3-W2.6-LS5.2-RD]  39.36 50.02 180 top
D1_L1  US1M  [SMA_L4.4-W2.8-LS5.4-RD]  37.34 58.73 180 bottom
D1_L2  US1M  [SMA_L4.4-W2.8-LS5.4-RD]  37.34 29.26 180 bottom
D1_R1  US1M  [SMA_L4.4-W2.8-LS5.4-RD]  37.34 44.38 180 bottom
D1_R2  US1M  [SMA_L4.4-W2.8-LS5.4-RD]  36.95 13.26 180 bottom
D2_L1  US1M  [SMA_L4.4-W2.8-LS5.4-RD]  37.59 53.65 180 bottom
D2_L2  US1M  [SMA_L4.4-W2.8-LS5.4-RD]  37.34 22.53 180 bottom
D2_R1  US1M  [SMA_L4.4-W2.8-LS5.4-RD]  37.59 39.55 180 bottom
D2_R2  US1M  [SMA_L4.4-W2.8-LS5.4-RD]  37.08 6.28 180 bottom
D3_L1  US1M  [SMA_L4.4-W2.8-LS5.4-RD]  28.7 62.54 0 bottom
D3_L2  US1M  [SMA_L4.4-W2.8-LS5.4-RD]  28.7 30.79 0 bottom
D3_R1  US1M  [SMA_L4.4-W2.8-LS5.4-RD]  28.7 46.15 0 bottom
D3_R2  US1M  [SMA_L4.4-W2.8-LS5.4-RD]  28.57 14.28 0 bottom
D4_L1  US1M  [SMA_L4.4-W2.8-LS5.4-RD]  28.7 53.39 0 bottom
D4_L2  US1M  [SMA_L4.4-W2.8-LS5.4-RD]  28.57 22.53 0 bottom
D4_R1  US1M  [SMA_L4.4-W2.8-LS5.4-RD]  28.7 39.63 0 bottom
D4_R2  US1M  [SMA_L4.4-W2.8-LS5.4-RD]  28.7 6.91 0 bottom
D5_L1  FR107  [SOD-123_L2.8-W1.8-LS3.7-RD]  45.21 60 0 bottom
D5_L2  FR107  [SOD-123_L2.8-W1.8-LS3.7-RD]  44.7 29.14 0 bottom
D5_R1  FR107  [SOD-123_L2.8-W1.8-LS3.7-RD]  44.7 45.13 0 bottom
D5_R2  FR107  [SOD-123_L2.8-W1.8-LS3.7-RD]  44.7 13.39 0 bottom
H1  PZ254V-11-05P  [HDR-TH_5P-P2.54-V-M]  1.78 36.02 270 top
L1  4.7uh  [IND-SMD_L7.3-W6.6]  37.85 56.34 270 top
LED1  NCD0603R1  [LED0603-RD_RED]  43.37 27.61 90 top
LED2  NCD0603R1  [LED0603-RD_RED]  46.12 39.81 90 top
LED3  NCD0603R1  [LED0603-RD_RED]  41.12 40.69 180 top
P1  WJ500V-5.08-2P  [CONN-TH_2P-P5.00_WJ500V-5.08-2P]  5.84 71.38 90 top
P2  WJ500V-5.08-2P  [CONN-TH_2P-P5.00_WJ500V-5.08-2P]  5.71 13.51 90 top
Q1_L1  IRFR3607TRPBF  [TO-252-3_L6.5-W5.8-P4.58-BL]  27.81 61.02 90 top
Q1_L2  IRFR3607TRPBF  [TO-252-3_L6.5-W5.8-P4.58-BL]  27.81 29.64 90 top
Q1_R1  IRFR3607TRPBF  [TO-252-3_L6.5-W5.8-P4.58-BL]  27.81 45.34 90 top
Q1_R2  IRFR3607TRPBF  [TO-252-3_L6.5-W5.8-P4.58-BL]  27.81 13.86 90 top
Q2_L1  IRFR3607TRPBF  [TO-252-3_L6.5-W5.8-P4.58-BL]  27.81 53.14 90 top
Q2_L2  IRFR3607TRPBF  [TO-252-3_L6.5-W5.8-P4.58-BL]  27.81 21.83 90 top
Q2_R1  IRFR3607TRPBF  [TO-252-3_L6.5-W5.8-P4.58-BL]  27.81 37.5 90 top
Q2_R2  IRFR3607TRPBF  [TO-252-3_L6.5-W5.8-P4.58-BL]  27.81 6.15 90 top
R1_L1  10Ω  [R0603]  37.34 60.76 180 bottom
R1_L2  10Ω  [R0603]  37.08 31.42 180 bottom
R1_R1  10Ω  [R0603]  37.34 46.53 180 bottom
R1_R2  10Ω  [R0603]  37.08 15.93 180 bottom
R2  1kΩ  [R0603]  41.17 27.61 90 top
R2_L1  10Ω  [R0603]  37.59 56.06 180 bottom
R2_L2  10Ω  [R0603]  37.34 25.33 180 bottom
R2_R1  10Ω  [R0603]  37.34 41.96 180 bottom
R2_R2  10Ω  [R0603]  37.34 9.07 180 bottom
R3  1kΩ  [R0603]  44.34 39.86 270 top
R4  10kΩ  [R0603]  45.85 46.83 0 top
R5  1kΩ  [R0603]  45.78 50.79 0 top
R6  9.1kΩ  [R0603]  45.85 48.97 0 top
R7  4.7kΩ  [R0603]  10.03 36.35 0 top
R8  4.7kΩ  [R0603]  10.03 34.34 0 top
R9  4.7kΩ  [R0603]  10.03 30.28 0 top
R10  4.7kΩ  [R0603]  10.03 32.31 0 top
R11  1kΩ  [R0603]  41.08 42.75 180 top
R12  0Ω  [R0805]  36.23 67.11 0 top
U1  AMS1117-3.3  [SOT-223-4_L6.5-W3.5-P2.30-LS7.0-BR]  40.92 35.87 180 top
U1_L1  EG2104  [SOP-8_L5.0-W4.0-P1.27-LS6.2-BL]  45.34 56.06 270 bottom
U1_L2  EG2104  [SOP-8_L5.0-W4.0-P1.27-LS6.2-BL]  45.59 24.56 270 bottom
U1_R1  EG2104  [SOP-8_L5.0-W4.0-P1.27-LS6.2-BL]  45.59 41.07 270 bottom
U1_R2  EG2104  [SOP-8_L5.0-W4.0-P1.27-LS6.2-BL]  45.46 9.58 270 bottom
U2  AMS1117-5.0  [SOT-223_L6.7-W3.5-P2.30-BR]  37.99 23.69 270 top
U3  SX1308  [SOT-23-6_L2.9-W1.6-P0.95-LS2.8-BL]  43.94 54.18 0 top
U4  XL74HC245  [SOP-20_L12.8-W7.5-P1.27-LS10.4-BL]  10.29 34.54 90 bottom
U5  HX SS12D10G4  [SW-TH_SHOU-HAN_SS12D10G4]  40.51 73.22 0 top

## Footprints (pads in the part's own frame, mm; a bottom-side part is the same pattern mirrored in y, then rotated)
C0603
  rect 0.8x0.9 smd: 1(-0.7,0) 2(0.7,0)
CAP-SMD_BD8.0-L8.3-W8.3-LS9.3-FD
  rect 4.6x1.6 smd: 1(-3.724,0) 2(3.724,0)
CONN-TH_2P-P5.00_WJ500V-5.08-2P
  round 2 hole 1.3: 1(-2.54,0) 2(2.54,0)
CONN-TH_XT30UPB-M
  round 2.5 hole 1.8: 1(-2.5,0) 2(2.5,0)
HDR-TH_5P-P2.54-V-M
  rect 1.7x1.7 hole 1.1: 1(-5.08,0)
  round 1.7 hole 1.1: 2(-2.54,0) 3(0,0) 4(2.54,0) 5(5.08,0)
IND-SMD_L7.3-W6.6
  rect 2.424x3.42 smd: 1(3.278,0) 2(-3.278,0)
LED0603-RD_RED
  rect 0.8x0.8 smd: 1(-0.799,-0.004) 2(0.799,0.004)
R0603
  rect 0.806x0.864 smd: 1(-0.753,0) 2(0.753,0)
R0805
  rect 1.133x1.377 smd: 1(-1,0) 2(1,0)
SMA_L4.3-W2.6-LS5.2-RD
  rect 2x2 smd: 1(-2.2,0) 2(2.2,0)
SMA_L4.4-W2.8-LS5.4-RD
  rect 2.046x1.62 smd: 1(-2.566,0) 2(2.566,0)
SOD-123_L2.8-W1.8-LS3.7-RD
  rect 0.95x1.15 smd: 1(-1.692,0) 2(1.692,0)
SOP-8_L5.0-W4.0-P1.27-LS6.2-BL
  oval 0.7x1.7 smd: 1(-1.905,-2.9) 2(-0.635,-2.9) 3(0.635,-2.9) 4(1.905,-2.9) 5(1.905,2.9) 6(0.635,2.9) 7(-0.635,2.9) 8(-1.905,2.9)
SOP-20_L12.8-W7.5-P1.27-LS10.4-BL
  oval 0.6x2.3 smd: 1(-5.715,-4.55) 2(-4.445,-4.55) 3(-3.175,-4.55) 4(-1.905,-4.55) 5(-0.635,-4.55) 6(0.635,-4.55) 7(1.905,-4.55) 8(3.175,-4.55) 9(4.445,-4.55) 10(5.715,-4.55) 11(5.715,4.55) 12(4.445,4.55) 13(3.175,4.55) 14(1.905,4.55) 15(0.635,4.55) 16(-0.635,4.55) 17(-1.905,4.55) 18(-3.175,4.55) 19(-4.445,4.55) 20(-5.715,4.55)
SOT-23-6_L2.9-W1.6-P0.95-LS2.8-BL
  rect 0.532x1.072 smd: 1(-0.95,-1.149) 2(0,-1.149) 3(0.95,-1.149) 4(0.95,1.149) 5(0,1.149) 6(-0.95,1.149)
SOT-223-4_L6.5-W3.5-P2.30-LS7.0-BR
  rect 2.47x0.98 smd: 1(2.835,-2.3) 2(2.835,0) 3(2.835,2.3)
  rect 2.47x3.6 smd: 4(-2.835,0)
SOT-223_L6.7-W3.5-P2.30-BR
  rect 2.2x1.1 smd: 1(3.099,-2.3) 2(3.099,0) 3(3.099,2.3)
  rect 2.2x3.5 smd: 4(-3.099,0)
SW-TH_SHOU-HAN_SS12D10G4
  oval 1.7x2.9 hole 1.1x2.3: 1(-4.8,0) 2(0,0) 3(4.8,0)
TO-252-3_L6.5-W5.8-P4.58-BL
  rect 1.27x2.54 smd: 1(-2.288,-3.747) 3(2.288,-3.745)
  rect 5.4x6.1 smd: 2(-0.002,3.747)

## Nets
As in the schematic.

Pads without a net: U1 2; U2 2; U3 6; U5 3

## Via types
v1: diameter 0.61, hole 0.305, Top Layer to Bottom Layer, 127 vias

## Routing (per net, layer and track width the routed paths; a pad name or vN(x,y) marks a point on that pad's centre or on a via; arc(x,y) is an arc through that point)
3V3: length 110.4
  Top Layer w0.635: C8.2 46.53,6.45 42.54,2.47 12.57,2.47 7.75,7.29 v1(7.75,18.98)
  Top Layer w0.762: 46.53,36.12 46.28,35.87 U1.4 44.34,36.45 R3.2 ; 46.67,33.91 46.53,34.05 C7.2
  Bottom Layer w0.635: U4.1 5.74,27.46 6.73,26.47 7.74,26.47 ; U4.20 14.99,28.68 14.99,27.48 13.97,26.47 7.74,26.47 ; 7.74,26.47 7.74,25.17 7.74,25.17 7.74,23.36 7.68,23.29 7.68,19.04 v1(7.75,18.98)
  vias: v1(36.58,24.06) v1(36.58,22.91) v1(37.99,24.06) v1(37.99,22.91) v1(40.26,37.52) v1(40.36,35.87) v1(41.6,37.52) v1(41.58,35.87)
5V: length 10.6
  Top Layer w0.762: 37.67,29.14 37.67,27.11 U2.4 41.09,26.79 R2.1 ; U1.3 37.67,33.57 C4.2 37.72,30.87 C3.2
12V: length 127.5
  Top Layer w0.762: 51.44,32.11 51.44,20.75 v1(50.42,19.74) ; 51.44,32.11 51.36,32.18 v1(49.66,32.18) ; 51.44,32.11 51.44,44.84 ; C11.1 41.83,49.48 41.57,49.74 41.57,50.02 ; C11.1 C12.1 ; C11.1 44.82,46.84 45.09,47.11 ; v1(48.51,46.41) 49.4,47.3 51.44,47.3 ; C12.1 41.83,42.75 R11.1 ; C12.1 51.44,44.84 ; 51.44,44.84 51.44,47.3 ; 51.44,47.3 51.44,63.43 50.67,64.19 v1(49.91,64.19)
  Bottom Layer w0.762: C1_R1.2 48.51,45.16 v1(48.51,46.41) ; C1_R1.2 46.4,45.14 D5_R1.2 ; C1_R1.2 U1_R1.1 49.78,42.98 50.42,42.34 50.42,41.07 49.78,40.44 U1_R1.3 ; U1_L2.3 49.91,23.93 50.55,24.56 50.55,25.58 49.66,26.47 U1_L2.1 C1_L2.2 ; v1(50.42,19.74) 48.39,17.71 48.39,13.45 C1_R2.2 ; 48.45,60 48.45,63.8 48.83,64.19 v1(49.91,64.19) ; 48.45,60 48.45,58.17 U1_L1.1 49.28,57.96 49.91,57.33 49.91,56.19 49.15,55.42 48.24,55.42 ; 48.45,60 D5_L1.2 ; C1_L2.2 48.51,29.16 48.51,31.29 49.4,32.18 v1(49.66,32.18) ; C1_L2.2 D5_L2.2 ; C1_R2.2 48.31,13.38 46.65,13.38 ; C1_R2.2 48.32,11.52 U1_R2.1 49.66,11.48 50.42,10.72 50.42,9.7 49.66,8.94 48.36,8.94
PGND:
  vias: v1(20.7,68.53) v1(20.7,65.72) v1(30.62,22.16) v1(30.63,8.44) v1(30.82,53.14) v1(30.77,24.11) v1(30.81,6.05) v1(30.92,55.43) v1(30.94,40.07) v1(30.94,38.07) v1(32.29,55.43) v1(32.28,40.07) v1(32.28,38.07) v1(32.32,8.44) v1(32.43,53.14) v1(32.38,24.31) v1(32.39,22.16) v1(32.38,6.05)
VBAT: length 49.5
  Top Layer w0.762: U3.4 U3.5 43.94,57.29 C10.2 ; U5.2 41.4,72.33 41.4,67.36 43.88,64.89 43.88,59.51 ; 39.03,59.51 38.14,59.51 ; 39.03,59.51 43.88,59.51 ; 39.03,59.51 39.28,59.26 ; 39.03,59.51 38.92,59.62 L1.2 ; 43.88,59.51 43.88,57.67 43.94,57.61 ; 24.07,13.99 24.07,17.13 25.02,18.09 v1(26.54,18.09) ; U2.3 40.29,18.27 40.11,18.09 v1(36.83,18.09)
  Bottom Layer w0.762: v1(26.54,18.09) v1(36.83,18.09)
  vias: v1(21.84,62.92) v1(21.84,61.39) v1(21.84,59.74) v1(21.84,30.66) v1(21.84,29.01) v1(22.1,46.79) v1(22.1,44.95) v1(22.1,43.19) v1(22.48,15.67) v1(22.53,13.86) v1(22.48,11.99) v1(23.21,62.92) v1(23.24,61.39) v1(23.21,59.74) v1(24.07,46.79) v1(24.07,44.95) v1(24.07,43.19) v1(24.07,30.66) v1(24.07,29.01) v1(24.45,15.67) v1(24.45,13.86) v1(24.45,11.99) v1(24.58,62.92) v1(24.64,61.39) v1(24.6,59.74) v1(25.9,46.79) v1(25.9,44.95) v1(25.9,43.19) v1(26.23,28.95) v1(26.27,30.66) v1(26.43,15.64) v1(26.43,13.86) v1(26.44,11.99)
ML+: length 73.1
  Bottom Layer w0.635: C2_L1.2 44.77,61.8 44.83,61.74 44.83,57.33 42.93,55.42 42.44,55.42 ; v1(30.84,60.89) 31.52,60.89 31.78,61.14 31.78,63.96 32.26,64.44 43.81,64.44 44.83,63.43 44.83,62.35 44.7,62.22
  Bottom Layer w1.524: D3_L1.2 29.46,62.54 28.7,61.77 28.7,53.99 27.98,53.27 26.64,53.27
  Bottom Layer w2.54: P1.2 12.19,67.57 12.19,58.35 17.02,53.52 25.4,53.52
  vias: v1(22.48,54.92) v1(22.49,53.2) v1(22.49,51.6) v1(24.07,54.91) v1(24.07,53.14) v1(24.07,51.6) v1(25.54,54.91) v1(25.54,53.2) v1(25.54,51.6) v1(30.99,63.04) v1(32.29,63.04) v1(32.32,60.89)
ML-: length 76.7
  Bottom Layer w0.635: v1(32.09,47.8) 32.09,48.78 32.64,49.33 41.74,49.33 ; 41.74,49.33 C2_R1.2 ; 41.74,49.33 43.18,49.33 44.32,48.19 44.32,40.95 43.81,40.44 U1_R1.6
  Bottom Layer w1.524: 26.54,38.53 27.94,38.53 28.7,39.3 28.7,45.26 29.59,46.15 31.65,46.15
  Bottom Layer w2.54: 5.84,68.84 5.84,58.35 18.16,46.03 18.16,39.17 19.56,37.77 v1(22.1,37.77) 22.35,37.52
  vias: v1(22.1,39.42) v1(22.1,36.12) v1(23.95,39.42) v1(24,37.77) v1(24,36.12) v1(25.88,39.42) v1(25.91,37.77) v1(25.91,36.12) v1(30.94,46.06) v1(30.99,47.8) v1(32.13,45.9)
MR+: length 60
  Bottom Layer w0.381: 31.65,30.15 32.38,30.15
  Bottom Layer w0.508: C2_L2.2 41.49,31.59
  Bottom Layer w0.635: 32.38,30.79 32.13,31.04 ; 32.38,30.79 32.38,30.15 ; 32.38,30.79 D3_L2.2 ; 32.13,31.04 32.17,31.08 32.17,31.13 32.13,31.17 ; 32.13,31.04 31.37,31.8 31.37,32.44 41.36,32.44 ; U1_L2.6 43.69,23.93 44.45,24.69 44.45,31.17 43.18,32.44 41.36,32.44 ; 41.36,32.44 41.49,32.31 41.49,31.59
  Bottom Layer w1.524: 31.65,30.15 29.59,30.15 28.83,29.39 28.83,23.42 27.94,22.53 D4_L2.1
  Bottom Layer w2.54: P2.2 11.94,16.05 17.65,21.77 22.86,21.77
  vias: v1(21.84,23.17) v1(21.84,21.01) v1(24.07,23.17) v1(24.07,21.08) v1(26.07,23.17) v1(26.15,21.09) v1(30.86,31.29) v1(30.93,29.64) v1(32.12,31.34) v1(32.23,29.64)
MR-: length 52.5
  Bottom Layer w0.635: 42.56,8.94 43.6,8.94 44.32,9.67 44.32,16.18 43.43,17.07 41.74,17.07 ; C2_R2.2 41.74,17.07 ; 41.74,17.07 32.84,17.07 v1(32.2,16.44)
  Bottom Layer w1.524: v1(26.07,7.93) 26.19,7.8 27.71,7.8 28.83,8.92 28.83,13.41 29.69,14.28 D3_R2.2
  Bottom Layer w2.54: 22.73,6.4 18.41,6.4 13.84,10.97 P2.1
  vias: v1(22.22,7.93) v1(22.22,5.74) v1(22.22,3.99) v1(24.13,7.93) v1(24.07,5.74) v1(24.07,3.99) v1(26.15,5.74) v1(26.16,3.74) v1(30.61,16.44) v1(30.81,13.86) v1(32.24,13.86)
PWM1: length 58.5
  Top Layer w0.254: R7.2 12.06,36.35
  Bottom Layer w0.254: U1_L1.2 46.61,56.69 45.59,55.68 45.59,36.25 44.2,34.85 17.53,34.85 17.2,35.18 U4.15 13.13,35.18 12.06,36.25 v1(12.06,36.32)
PWM2: length 44.3
  Top Layer w0.254: v1(12.06,34.34) R8.2
  Bottom Layer w0.254: U1_R1.2 48.37,41.84 47.5,41.84 46.99,41.33 46.99,35.99 45.34,34.34 15.27,34.34 U4.16 12.5,33.91 v1(12.06,34.34)
PWM3: length 46
  Top Layer w0.254: 12.32,32.31 R10.2
  Bottom Layer w0.254: U1_L2.2 45.9,25.2 45.64,25.45 45.64,32.39 44.2,33.83 18.25,33.83 17.06,32.64 U4.17 12.65,32.64 12.32,32.31
  vias: v1(12.06,32.31)
PWM4: length 60
  Top Layer w0.254: v1(12.06,30.41) 10.91,30.41 R9.2
  Bottom Layer w0.254: U1_R2.2 46.86,10.21 45.24,11.84 45.24,31.52 43.43,33.33 19.02,33.33 17.06,31.37 U4.18 14.76,31.29 13.23,31.29 13.23,31.19 12.45,30.41 v1(12.06,30.41)
$3N995: length 9.5
  Top Layer w0.508: Q2_L1.1 34.16,50.85 v1(34.92,51.61)
  Bottom Layer w0.508: v1(34.92,51.61) 34.92,53.55 D2_L1.2 35.03,55.27 35.69,55.93 36.71,55.93 R2_L1.2
$3N996: length 7.9
  Bottom Layer w0.508: U1_L1.7 40.26,56.69 39.9,57.05 D1_L1.1 40,58.83 40,60 39.24,60.76 38.09,60.76 R1_L1.1
$3N997: length 6.3
  Bottom Layer w0.381: D2_L1.1 40.67,54.15 U1_L1.5
  Bottom Layer w0.508: D2_L1.1 40.16,55.27 39.5,55.93 38.35,55.93 R2_L1.1
$3N999: length 4.8
  Bottom Layer w0.508: C2_L1.1 43.52,61.88 D5_L1.1
  Bottom Layer w0.762: U1_L1.8 42.44,59.26 43.18,60 D5_L1.1
$3N1006: length 8.6
  Bottom Layer w0.508: U1_R1.7 41.28,41.71 39.9,43.08 D1_R1.1 39.75,44.53 39.75,46.15 39.37,46.53 37.81,46.53
$3N1007: length 8.5
  Top Layer w0.508: v1(34.29,42.72) 34.16,42.6 32.02,42.6 Q1_R1.1
  Bottom Layer w0.508: 36.3,46.53 35.18,46.53 34.54,45.9 34.54,44.6 D1_R1.2 34.77,43.21 v1(34.29,42.72)
$3N1008: length 6.7
  Bottom Layer w0.508: U1_R1.5 40.54,39.17 D2_R1.1 40.16,41.18 39.37,41.96 R2_R1.1
$3N1009: length 11.1
  Top Layer w0.508: Q2_R1.1 34.16,35.21 34.8,35.85 v1(34.8,36.25)
  Bottom Layer w0.508: R2_R1.2 35.56,41.96 34.8,41.2 34.8,39.78 D2_R1.2 34.8,39.32 v1(34.8,36.25)
$3N1011: length 4.4
  Bottom Layer w0.508: 43.12,47.17 43.12,45.23 D5_R1.1 43.05,45.09 43.05,43.34 U1_R1.8
$3N1019: length 9.2
  Top Layer w0.381: v1(33.53,56.69) 33.02,56.69 31.56,58.15 Q1_L1.1
  Bottom Layer w0.381: D1_L1.2 34.77,57.3 34.16,56.69 v1(33.53,56.69)
  Bottom Layer w0.508: D1_L1.2 34.77,60.1 35.44,60.76 36.3,60.76
$3N2169: length 9.6
  Top Layer w0.508: Q2_L2.1 33.71,19.54 v1(34.29,20.12)
  Bottom Layer w0.508: v1(34.29,20.12) 34.29,22.05 ; D2_L2.2 34.77,24.79 35.31,25.33 36.33,25.33
  Bottom Layer w0.762: 34.29,22.05 D2_L2.2
$3N2170: length 10.2
  Bottom Layer w0.508: 39.88,29.29 39.75,29.42 39.75,30.79 39.24,31.29 37.91,31.29 37.84,31.37 R1_L2.1 ; 39.88,29.29 39.88,26.47 41.15,25.2 U1_L2.7 ; 39.88,29.29 39.88,29.49 39.9,29.52
$3N2171: length 7.2
  Bottom Layer w0.381: U1_L2.5 42.57,22.53 D2_L2.1
  Bottom Layer w0.508: D2_L2.1 39.88,22.56 39.88,24.56 39.12,25.33 37.84,25.33
$3N2173: length 5.1
  Bottom Layer w0.508: U1_L2.8 43.01,26.79 D5_L2.1 43.01,31.3 42.89,31.18 C2_L2.1
$3N2190: length 9.2
  Bottom Layer w0.508: 38.09,15.93 38.99,15.93 39.52,15.4 D1_R2.1 39.52,11.33 40.64,10.21 U1_R2.7
$3N2191: length 8.7
  Top Layer w0.508: 31.56,11.7 32.03,11.23 v1(33.53,11.23)
  Bottom Layer w0.508: v1(33.53,11.23) 34.39,12.09 D1_R2.2 34.39,15.14 35.18,15.93 R1_R2.2
$3N2192: length 7.5
  Bottom Layer w0.508: R2_R2.1 39.12,9.07 39.62,8.56 39.62,6.3 D2_R2.1 41.16,6.28 U1_R2.5
$3N2193: length 9.3
  Top Layer w0.508: Q2_R2.1 33.78,3.86 v1(34.29,4.37)
  Bottom Layer w0.508: v1(34.29,4.37) 34.29,6.05 D2_R2.2 34.54,6.3 34.54,8.31 35.31,9.07 R2_R2.2
$3N2195: length 4.5
  Bottom Layer w0.508: 43.14,13.39 C2_R2.1 ; 43.14,13.39 43.14,13.38 43.27,13.38 ; 43.14,13.39 43.26,13.39 43.27,13.38 ; 43.14,13.39 D5_R2.1 ; 43.27,13.38 43.06,13.18 43.06,11.99 U1_R2.8
$3N2213: length 8.1
  Top Layer w0.508: Q1_L2.1 31.56,27.36 v1(34.16,27.36)
  Bottom Layer w0.508: v1(34.16,27.36) 34.77,27.97 34.77,30.84 35.36,31.42 R1_L2.2
$3N2727: length 1.8
  Top Layer w0.762: LED2.2 46.11,40.61 44.34,40.61
$3N2731: length 2.2
  Top Layer w0.762: R2.2 43.32,28.37 LED1.2
$3N3245: length 8.4
  Top Layer w0.762: 39.37,53.03 37.88,53.03 L1.1 37.17,52.38 37.17,50.02 ; 39.37,53.03 42.67,53.03 ; 39.37,53.03 39.21,53.19
$3N3247: length 1.9
  Top Layer w0.762: 46.6,47.11 R6.2
$3N3248: length 4.1
  Top Layer w0.762: R6.1 45.02,49.04 R5.1 45.02,52.9 U3.3
$3N3249: length 2.1
  Top Layer w0.762: R11.2 40.32,40.78 40.23,40.69
$3N4523: length 7.7
  Bottom Layer w0.381: U4.5 4.32,33.91 3.94,34.29 3.94,37.39 2.79,38.53 1.78,38.53
$3N4524: length 5.8
  Bottom Layer w0.381: H1.3 3.05,34.75 3.05,33.96 4.37,32.64 U4.4
$3N4525: length 4.8
  Bottom Layer w0.381: H1.4 3.89,31.37 U4.3
$3N4526: length 4.3
  Bottom Layer w0.381: U4.2 2.62,30.1 H1.5

## Copper pours and planes (outline as drawn; the poured copper is in the pictures)
GND on Top Layer: -105.66,87.17 -44.45,87.17 -44.45,-6.81 -105.66,-6.81
GND on Top Layer: 36.7,69.14 40.51,69.14 40.51,65.2 36.7,65.2
GND on Bottom Layer: 114.68,87.56 174.88,87.56 174.88,-6.93 114.68,-6.93
PGND on Top Layer: 19.61,69.39 35.78,69.39 35.78,5.39 19.61,5.39
PGND on Bottom Layer: 30.1,24.94 32.95,24.94 32.95,21.68 30.1,21.68
PGND on Bottom Layer: 30.1,56.19 32.85,56.19 32.85,52.5 30.1,52.5
PGND on Bottom Layer: 30.1,40.69 32.87,40.69 32.87,37.5 30.1,37.5
PGND on Bottom Layer: 30.1,9.2 32.89,9.2 32.89,5.39 30.1,5.39
VBAT on Top Layer: 13.97,82.48 44.19,82.48 44.19,11.36 13.97,11.36
VBAT on Bottom Layer: 20.95,31.79 27.18,31.79 27.18,26.99 20.95,26.99
VBAT on Bottom Layer: 20.95,63.81 27.18,63.81 27.18,58.35 20.95,58.35
VBAT on Bottom Layer: 20.95,48.06 27.18,48.06 27.18,42.6 20.95,42.6
VBAT on Bottom Layer: 21.72,16.69 27.18,16.69 27.18,11.23 21.72,11.23
ML+ on Top Layer: 30.29,63.94 32.89,63.94 32.89,60.25 30.29,60.25
ML+ on Bottom Layer: 30.29,63.55 32.89,63.55 32.89,60.25 30.29,60.25
ML+ on Bottom Layer: 20.95,55.93 27.22,55.93 27.22,50.47 20.95,50.47
ML- on Top Layer: 30.23,48.31 32.78,48.31 32.78,45.34 30.23,45.34
ML- on Bottom Layer: 20.85,40.44 27.05,40.44 27.05,35.52 20.85,35.52
ML- on Bottom Layer: 30.23,48.44 32.8,48.44 32.8,45.34 30.23,45.34
MR+ on Top Layer: 30.23,32.56 32.89,32.56 32.89,29.26 30.23,29.26
MR+ on Bottom Layer: 30.23,32.95 32.89,32.95 32.89,29.26 30.23,29.26
MR+ on Bottom Layer: 20.95,24.56 26.92,24.56 26.92,18.95 20.95,18.95
MR- on Top Layer: 30.1,17.08 32.77,17.08 32.77,13.51 30.1,13.51
MR- on Bottom Layer: 21.08,8.94 26.89,8.94 26.89,3.48 21.08,3.48
MR- on Bottom Layer: 30.35,17.32 33.02,17.32 33.02,13.51 30.35,13.51
$3N4108 on Top Layer: 19.81,76.63 36.83,76.63 36.83,71.68 19.81,71.68

Small or netless copper shapes (teardrops, artwork), in the pictures only: 60 on Top Layer, 141 on Bottom Layer

## Text on the board
Bottom Silkscreen Layer: 104 | 10欧
Top Layer: 广东工业大学 / 共用电子队 / 2024
Top Silkscreen Layer: PWM2 | PWM3 | PWM4 | PWM1 | GND | 4.7k | 106 | 104 | 10k | 12v | 5v | 3.3v | 1k | 9.1k | -->ON | 0欧
